# EAGLE board MegaFly_rev3.1 (EAGLE 6.1)
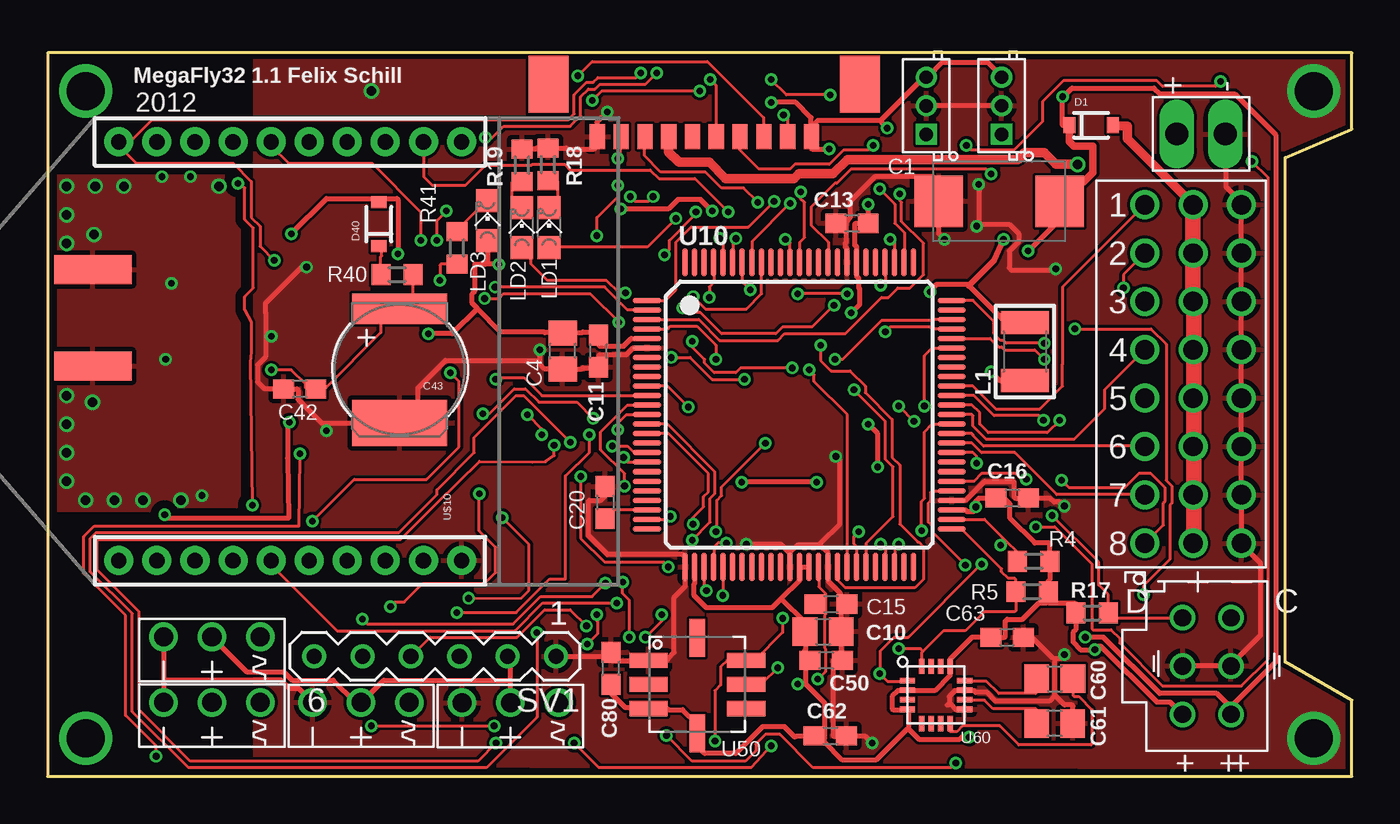
[diagram p3: board, top side]
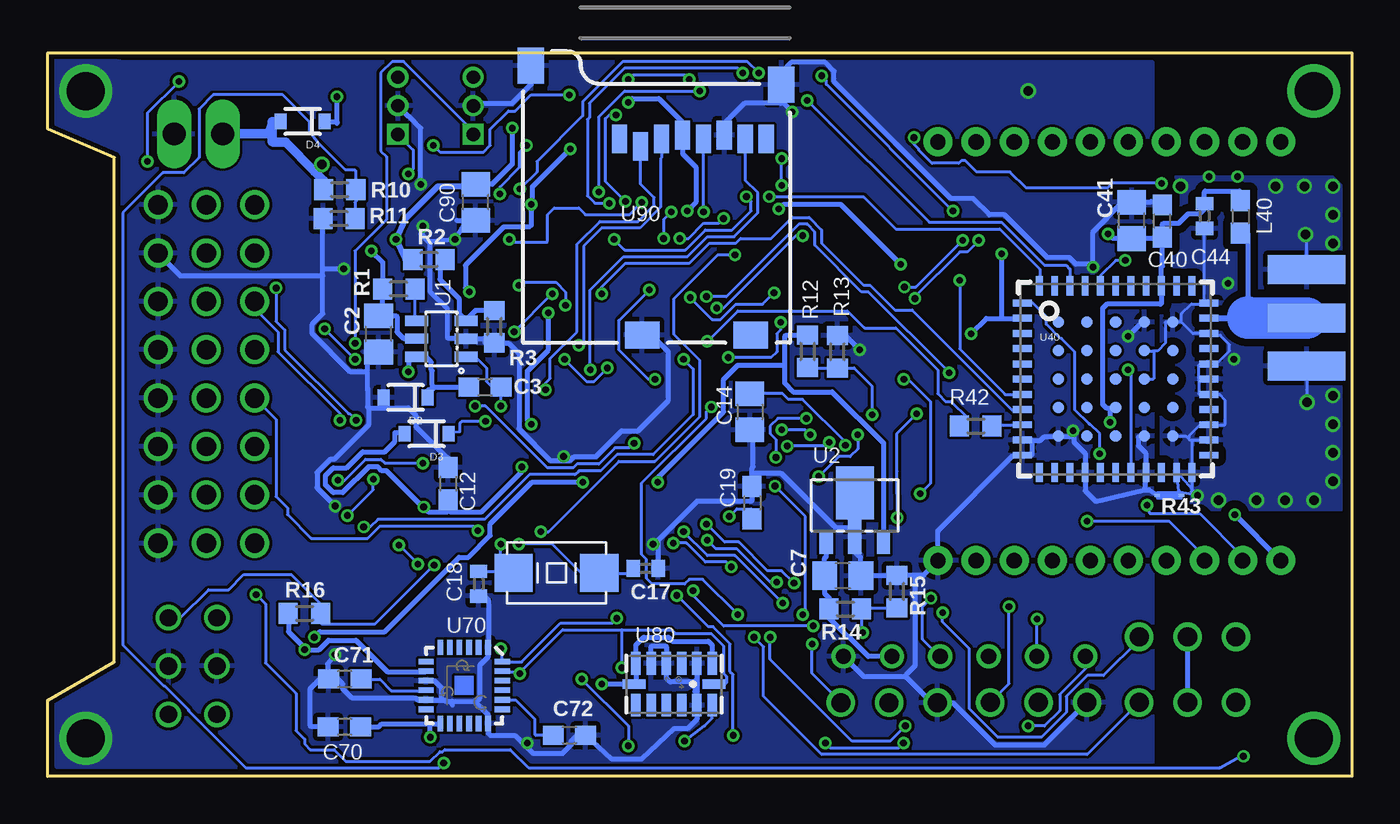
[diagram p4: board, bottom side, seen from below]

Size 68.5 x 38 mm. Coordinates in mm from the lower left corner, seen from the top.
Outline: 0,0 68.5,0 68.5,4 65,6 65,32.5 68.5,34 68.5,38 0,38 0,0
Copper layers (1*16): Top 0.035mm / dielectric 1mm / Bottom 0.035mm
Design rules: minimum track width 0.15mm, minimum drill 0.35mm, track to track 0.15mm, track to pad 0.15mm, pad to pad 0.15mm, via to via 0.15mm, smd to smd 0.15mm, copper to edge 10mil, drill to drill 8mil, minimum pad ring 8mil, minimum via ring 6mil, stop-mask expansion 4mil, vias tented up to drill 0.51mm, thermal gap 10mil
Net classes: 0 default: width 0.15 mm, drill 0.35 mm, clearance 0.15 mm; 1 power: width 0.25 mm, drill 0.35 mm, clearance 0.15 mm; 2 more_power: width 0.5 mm, drill 0.5 mm, clearance 0.15 mm

## Footprints (pad centres in the part's own frame; a part is rotated, then mirrored left to right if it is on the bottom)
D/7343-31R = smd 2.55 x 2.7: + 3.175,0; - -3.175,0
C0805 = smd 1.3 x 1.5: 1 -0.95,0; 2 0.95,0
C0603 = smd 1.1 x 1: 1 -0.85,0; 2 0.85,0
C0402 = smd 0.7 x 0.9: 1 -0.65,0; 2 0.65,0
EN_J2 = smd 5 x 1.6: + 0,-3.2 | smd 5 x 2.4: - 0,2.8
SOD-323 = smd 0.63 x 0.83: 1 -1.15,0; 2 1.15,0
SMA-EDGE = smd 1.524 x 4.064: GND@0 0,0; GND@1 5.08,0; SIG 2.54,0 | smd 1.524 x 4.064 bottom: GND@2 0,0; GND@3 5.08,0
C1210 = smd 1.2 x 2.5: 1 -1.524,0; 2 1.524,0
0603 = smd 1.1 x 1: 1 -0.85,0; 2 0.85,0
CHIPLED_0805 = smd 1.2 x 1.2: A 0,-1.05; C 0,1.05
R0603 = smd 1 x 1.1: 1 -0.85,0; 2 0.85,0
GND-JUMP = smd 0.305 x 0.152: 1 -0.635,0; 2 0.635,0
MA06-1 = drill 0.8 pad 1.27: 1 -6.35,0; 2 -3.81,0; 3 -1.27,0; 4 1.27,0; 5 3.81,0; 6 6.35,0
SOT23-6 = smd 0.55 x 1.2: 1 -0.95,-1.3; 2 0,-1.3; 3 0.95,-1.3; 4 0.95,1.3; 5 0.015,1.3; 6 -0.95,1.3
SOT89 = smd 0.7 x 1.1: 1 -1.5,-1.75; 3 1.5,-1.75 | smd 0.7 x 1.8: 2 0,-1.4 | smd 2 x 2.8: 4 0,0.9
TQFP100 = smd 1.5 x 0.3: 1 -8,6; 2 -8,5.5; 3 -8,5; 4 -8,4.5; 5 -8,4; 6 -8,3.5; 7 -8,3; 8 -8,2.5; 9 -8,2; 10 -8,1.5; 11 -8,1; 12 -8,0.5; 13 -8,0; 14 -8,-0.5; 15 -8,-1; 16 -8,-1.5; 17 -8,-2; 18 -8,-2.5; 19 -8,-3; 20 -8,-3.5; 21 -8,-4; 22 -8,-4.5; 23 -8,-5; 24 -8,-5.5; 25 -8,-6; 51 8,-6; 52 8,-5.5; 53 8,-5; 54 8,-4.5; 55 8,-4; 56 8,-3.5; 57 8,-3; 58 8,-2.5; 59 8,-2; 60 8,-1.5; 61 8,-1; 62 8,-0.5; 63 8,0; 64 8,0.5; 65 8,1; 66 8,1.5; 67 8,2; 68 8,2.5; 69 8,3; 70 8,3.5; 71 8,4; 72 8,4.5; 73 8,5; 74 8,5.5; 75 8,6 | smd 0.3 x 1.5: 26 -6,-8; 27 -5.5,-8; 28 -5,-8; 29 -4.5,-8; 30 -4,-8; 31 -3.5,-8; 32 -3,-8; 33 -2.5,-8; 34 -2,-8; 35 -1.5,-8; 36 -1,-8; 37 -0.5,-8; 38 0,-8; 39 0.5,-8; 40 1,-8; 41 1.5,-8; 42 2,-8; 43 2.5,-8; 44 3,-8; 45 3.5,-8; 46 4,-8; 47 4.5,-8; 48 5,-8; 49 5.5,-8; 50 6,-8; 76 6,8; 77 5.5,8; 78 5,8; 79 4.5,8; 80 4,8; 81 3.5,8; 82 3,8; 83 2.5,8; 84 2,8; 85 1.5,8; 86 1,8; 87 0.5,8; 88 0,8; 89 -0.5,8; 90 -1,8; 91 -1.5,8; 92 -2,8; 93 -2.5,8; 94 -3,8; 95 -3.5,8; 96 -4,8; 97 -4.5,8; 98 -5,8; 99 -5.5,8; 100 -6,8
VENUS638FLPX = smd 1 x 0.36: 1 -4.9,4; 2 -4.9,3.2; 3 -4.9,2.4; 4 -4.9,1.6; 5 -4.9,0.8; 6 -4.9,0; 7 -4.9,-0.8; 8 -4.9,-1.6; 9 -4.9,-2.4; 10 -4.9,-3.2; 11 -4.9,-4; 23 4.9,-4; 24 4.9,-3.2; 25 4.9,-2.4; 26 4.9,-1.6; 27 4.9,-0.8; 28 4.9,0; 29 4.9,0.8; 30 4.9,1.6; 31 4.9,2.4; 32 4.9,3.2; 33 4.9,4 | smd 0.36 x 1: 12 -4,-4.9; 13 -3.2,-4.9; 14 -2.4,-4.9; 15 -1.6,-4.9; 16 -0.8,-4.9; 17 0,-4.9; 18 0.8,-4.9; 19 1.6,-4.9; 20 2.4,-4.9; 21 3.2,-4.9; 22 4,-4.9; 34 4,4.9; 35 3.2,4.9; 36 2.4,4.9; 37 1.6,4.9; 38 0.8,4.9; 39 0,4.9; 40 -0.8,4.9; 41 -1.6,4.9; 42 -2.4,4.9; 43 -3.2,4.9; 44 -4,4.9 | smd 0.6 x 0.6: 45 -3,3; 46 -3,1.5; 47 -3,0; 48 -3,-1.5; 49 -3,-3; 50 -1.5,3; 51 -1.5,1.5; 52 -1.5,0; 53 -1.5,-1.5; 54 -1.5,-3; 55 0,3; 56 0,1.5; 57 0,0; 58 0,-1.5; 59 0,-3; 60 1.5,3; 61 1.5,1.5; 62 1.5,0; 63 1.5,-1.5; 64 1.5,-3; 65 3,3; 66 3,1.5; 67 3,0; 68 3,-1.5; 69 3,-3
BMP085 = smd 2 x 0.8: 1 -2.565,1.27; 2 -2.565,0; 3 -2.565,-1.27; 5 2.565,-1.27; 6 2.565,0; 7 2.565,1.27 | smd 0.8 x 2: 4 0,-2.565; 8 0,2.45
LPCC16_0.5MM = smd 0.8 x 0.3: P$1 -1.5,0.75; P$2 -1.5,0.25; P$3 -1.5,-0.25; P$4 -1.5,-0.75; P$9 1.5,-0.75; P$10 1.5,-0.25; P$11 1.5,0.25; P$12 1.5,0.75 | smd 0.3 x 0.8: P$5 -0.75,-1.5; P$6 -0.25,-1.5; P$7 0.25,-1.5; P$8 0.75,-1.5; P$13 0.75,1.5; P$14 0.25,1.5; P$15 -0.25,1.5; P$16 -0.75,1.5
QFN-24 = smd 0.8 x 0.3: 1 -2,1.25; 2 -2,0.75; 3 -2,0.25; 4 -2,-0.25; 5 -2,-0.75; 6 -2,-1.25; 13 2,-1.25; 14 2,-0.75; 15 2,-0.25; 16 2,0.25; 17 2,0.75; 18 2,1.25 | smd 0.3 x 0.8: 7 -1.25,-2; 8 -0.75,-2; 9 -0.25,-2; 10 0.25,-2; 11 0.75,-2; 12 1.25,-2; 19 1.25,2; 20 0.75,2; 21 0.25,2; 22 -0.25,2; 23 -0.75,2; 24 -1.25,2
LGA14 = smd 0.5 x 1.2: 1 2,1.1; 2 1.2,1.1; 3 0.4,1.1; 4 -0.4,1.1; 5 -1.2,1.1; 6 -2,1.1; 8 -2,-1.1; 9 -1.2,-1.1; 10 -0.4,-1.1; 11 0.4,-1.1; 12 1.2,-1.1; 13 2,-1.1 | smd 1.2 x 0.5: 7 -2.1,0; 14 2.1,0
MICRO-SD-SOCKET-PP = smd 0.8 x 1.5: 1 -8.94,10.7; 2 -7.84,10.3; 3 -6.74,10.7; 4 -5.64,10.9; 5 -4.54,10.7; 6 -3.44,10.9; 7 -2.34,10.7; 8 -1.24,10.7 | smd 1.8 x 1.4: CD1 -2.05,0.4; CD2 -7.75,0.4 | smd 1.4 x 1.9: GND1 -13.6,14.55; GND3 -0.45,13.55
MOLEX_CONNECTOR_10PINS = smd 0.8 x 1.3: P$1 -11.65,-0.65; P$2 -10.4,-0.65; P$3 -9.15,-0.65; P$4 -7.9,-0.65; P$5 -6.65,-0.65; P$6 -5.4,-0.65; P$7 -4.15,-0.65; P$8 -2.9,-0.65; P$9 -1.65,-0.65; P$10 -0.4,-0.65 | smd 2.1 x 3: P$11 -14.2,-3.4; P$12 2.15,-3.4
HEADER3X8 = drill 1.016: P$1 -2.54,10.16; P$2 0,10.16; P$3 2.54,10.16; P$4 -2.54,7.62; P$5 0,7.62; P$6 2.54,7.62; P$7 -2.54,5.08; P$8 0,5.08; P$9 2.54,5.08; P$10 -2.54,2.54; P$11 0,2.54; P$12 2.54,2.54; P$13 -2.54,0; P$14 0,0; P$15 2.54,0; P$16 -2.54,-2.54; P$17 0,-2.54; P$18 2.54,-2.54; P$19 -2.54,-5.08; P$20 0,-5.08; P$21 2.54,-5.08; P$22 -2.54,-7.62; P$23 0,-7.62; P$24 2.54,-7.62
SMD_CRYSTAL_ABM = smd 2 x 2: P$1 -2.25,0; P$2 2.25,0
POWER = drill 1.2 long: P$1 0,2.54; P$2 0,0
XBEE-1 = drill 0.8 pad 1.524: 1 -11,20; 2 -11,18; 3 -11,16; 4 -11,14; 5 -11,12; 6 -11,10; 7 -11,8; 8 -11,6; 9 -11,4; 10 -11,2; 11 11,2; 12 11,4; 13 11,6; 14 11,8; 15 11,10; 16 11,12; 17 11,14; 18 11,16; 19 11,18; 20 11,20
JST_1.5MM_3WAY = drill 0.7 square: P$1 0,1.5 | drill 0.7: P$2 0,0; P$3 0,-1.5
SERVO_COMPACT = drill 1: P$1 0,2.54; P$2 0,0; P$3 0,-2.54
I2C-HEADER = drill 0.9: P$1 -2.54,5.08; P$2 0,5.08; P$3 -2.54,2.54; P$4 0,2.54; P$5 -2.54,0; P$6 0,0

## Placement (x,y rotation side)
C1  100uF  [D/7343-31R]  49.98,30.21 0 top
C2  10uF  [C0805]  51.12,23.23 90 bottom
C3  100nF  [C0603]  45.53,20.44 0 bottom
C4  10uF  [C0805]  27.05,22.34 90 top
C7  10uF  [C0805]  26.73,10.53 180 bottom
C10  10uF  [C0805]  40.73,7.6 0 top
C11  100nF  [C0603]  28.94,22.34 90 top
C12  100nF  [C0603]  47.47,15.37 270 bottom
C13  100nF  [C0603]  42.25,29.05 0 top
C14  10uF  [C0805]  31.62,19.15 270 bottom
C15  100nF  [C0603]  41.14,9.04 0 top
C16  100nF  [C0603]  50.66,14.62 180 top
C17  22pF  [C0402]  37.09,10.92 0 bottom
C18  22pF  [C0402]  45.86,10.11 270 bottom
C19  100nF  [C0603]  31.5,14.37 270 bottom
C20  100nF  [C0603]  29.28,14.38 270 top
C40  100nF  [C0603]  9.96,29.17 90 bottom
C41  10uF  [C0805]  11.57,29.2 90 bottom
C42  100nF  [C0603]  13.24,20.35 180 top
C43  0.2F  [EN_J2]  18.48,21.36 180 top
C44  22pF  [C0402]  7.74,29.43 270 bottom
C50  100nF  [C0603]  40.89,6.09 180 top
C60  220nF  [C0805]  52.9,5.13 0 top
C61  4.7uF  [C0805]  52.89,2.78 180 top
C62  100nF  [C0603]  41.11,2.12 0 top
C63  100nF  [C0603]  50.39,7.31 0 top
C70  100nF  [C0603]  52.91,2.6 180 bottom
C71  100nF  [C0603]  52.89,5.12 180 bottom
C72  2.2nF  [C0603]  41.09,2.16 0 bottom
C80  100nF  [C0603]  29.6,5.67 90 top
C90  10uF  [C0805]  46.02,30.15 90 bottom
D1  [SOD-323]  54.8,34.2 0 top
D2  [SOD-323]  49.7,19.9 180 bottom
D3  [SOD-323]  48.6,18 180 bottom
D4  [SOD-323]  55.1,34.4 180 bottom
D40  [SOD-323]  17.4,29 90 top
JP5  SMA_EDGE  [SMA-EDGE]  2.38,26.62 270 bottom
L1  10uH  [C1210]  51.33,22.31 90 top
L40  33nH  [0603]  5.85,29.39 270 bottom
LD1  [CHIPLED_0805]  26.34,28.83 0 top
LD2  [CHIPLED_0805]  24.9,28.82 0 top
LD3  [CHIPLED_0805]  23.1,29.2 0 top
R1  100k  [R0603]  50.06,25.6 180 bottom
R2  31.6k  [R0603]  48.47,27.14 0 bottom
R3  10k  [R0603]  45.04,23.62 270 bottom
R4  4k7  [R0603]  51.79,11.29 180 top
R5  4k7  [R0603]  51.7,9.7 180 top
R10  10k  [R0603]  53.16,30.81 180 bottom
R11  1k  [R0603]  53.19,29.3 0 bottom
R12  10k  [R0603]  28.59,22.32 90 bottom
R13  1k  [R0603]  27.02,22.3 270 bottom
R14  5.6k  [R0603]  26.61,8.78 180 bottom
R15  1k  [R0603]  23.9,9.7 270 bottom
R16  4k7  [R0603]  55.01,8.55 0 bottom
R17  4k7  [R0603]  54.86,8.58 0 top
R18  1k  [R0603]  26.28,32.14 270 top
R19  1k  [R0603]  24.91,32.1 270 top
R40  330  [R0603]  18.36,26.35 0 top
R41  330  [R0603]  21.5,27.76 270 top
R42  10k  [R0603]  19.76,18.4 0 bottom
R43  0  [GND-JUMP]  9.59,14.75 0 bottom
SV1  [MA06-1]  20.35,6.3 180 top
U1  LM2734  [SOT23-6]  47.81,22.98 90 bottom
U2  LDO_3PINSOT89_MC78LXX  [SOT89]  26.11,13.98 0 bottom
U10  AT32UC3C1512/1256/1128  [TQFP100]  39.48,19 0 top
U40  VENUS638FLPX-L  [VENUS638FLPX]  12.41,20.86 0 bottom
U50  BMP085  [BMP085]  34.12,4.83 0 top
U60  HMC5883L  [LPCC16_0.5MM]  46.66,4.27 0 top
U70  ITG-3200  [QFN-24]  46.62,4.77 270 bottom
U80  ADXL345  [LGA14]  35.61,4.84 0 bottom
U90  USD-SOCKETNEW  [MICRO-SD-SOCKET-PP]  29.52,22.78 0 bottom
U$1  AVR32_JTAG+SERIAL  [MOLEX_CONNECTOR_10PINS]  28.47,32.95 180 top
U$3  SERVOCONNECTOR_X8STANDARD  [HEADER3X8]  60.16,19.87 0 top
U$8  CRYSTAL  [SMD_CRYSTAL_ABM]  41.77,10.68 0 bottom
U$9  POWER  [POWER]  61.85,33.74 90 top
U$10  XBEE-1B1  [XBEE-1]  23.74,22.33 90 top
U$11  SPEKTRUM_RECEIVER  [JST_1.5MM_3WAY]  50.1,35.23 180 top
U$12  SPEKTRUM_RECEIVER  [JST_1.5MM_3WAY]  46.14,35.22 180 top
U$13  SENSOR  [SERVO_COMPACT]  24.3,3.87 270 top
U$15  SENSOR  [SERVO_COMPACT]  8.63,7.32 270 top
U$16  SENSOR  [SERVO_COMPACT]  16.46,3.88 270 top
U$17  SENSOR  [SERVO_COMPACT]  8.63,3.88 270 top
U$18  I2C-BUS  [I2C-HEADER]  62.15,3.25 0 top

## Tracks (layer width: path | path; a pad name or v marks a point on that pad's centre or on a via)
5V_ANA
  Top 0.25: 24.3,5.05 24.3,6.2 24.2,6.3 SV1.2 | 24.3,5.05 24.3,3.9 U$13.P$2 | U$15.P$2 8.65,7.3 10.45,5.5 12.4,5.5 12.85,5.05 15,5.05 16.15,3.9 16.45,3.9 U$16.P$2 16.55,3.95 17.65,5.05 24.3,5.05
  Bottom 0.25: U2.1 27.6,12.2 27.6,11.55 27.7,11.45 27.7,10.65 C7.2 27.7,10.5 27.7,9.6 27.45,9.35 27.45,8.8 R14.2 27.45,8.65 27.45,8.3 26.5,7.35 26.45,7.35 25.4,6.3 SV1.2 | U$17.P$2 8.65,3.9 8.65,7.3 U$15.P$2
+3V3  (via drill 0.35)
  Top 0.25: 22.7,26.9 22.45,26.9 22.45,25.5 22.3,25.35 22.3,24.85 22.57,24.57 | 22.57,24.57 23.8,23.35 26.05,23.35 26.1,23.3 C4.2 27.15,23.3 28.05,23.3 28.1,23.35 28.95,23.35 C11.2 28.95,23.1 28.95,22.65 29,22.6 30.25,22.6 30.65,23 U10.5 | v20,23.25 21.25,23.25 22.57,24.57 | 17.5,30.35 14.65,30.35 v12.8,28.5 | v6.15,13.75 6.35,13.55 12.65,13.55 12.6,16.7 12.6,18.5 v12.7,18.6 | v18.4,27.45 18.4,30.3 18.35,30.35 17.65,30.35 | v43.1,30.05 43.1,29.15 C13.2 43.05,29.05 42.45,29.05 42.4,29 42.4,27.9 42.5,27.8 42.5,27 U10.82 42.5,26.9 42.5,26.25 42.6,26.15 42.6,25.65 42.65,25.6 42.65,24.8 v42.2,24.35 | 40.17,34.17 40.45,34.45 43.75,34.45 | 40.17,34.17 40.1,34.1 40.1,33.6 U$1.P$1 40.1,33.5 40.1,33 40.15,32.95 v41.05,32.95 | 43.75,34.45 46,36.7 46.1,36.7 U$12.P$3 46.25,36.75 47,37.5 49.35,37.5 50.1,36.75 U$11.P$3 | v44.1,34.05 43.8,34.35 43.75,34.45 | v38,35.4 39.3,35.4 40.1,34.6 40.1,34.25 40.17,34.17 | v46.35,25.45 46.35,25.5 46.7,25.85 48.3,25.85 48.38,25.77 50.3,23.85 51.3,23.85 L1.2 | C80.1 29.6,4.35 30.35,3.6 30.55,3.6 30.6,3.55 U50.3 31.65,3.55 32.55,3.55 32.6,3.5 33.35,3.5 34.1,2.75 34.1,2.3 U50.4 34.1,2.15 34.1,1.6 34.5,1.2 36.15,1.2 37.55,2.6 38.7,2.6 39.25,2.05 39.3,2.1 40.15,2.1 C62.1 | 38.52,9.32 39.5,10.3 39.5,11 U10.38 U10.39 | 38.52,9.32 38.05,8.85 34.6,8.85 33.95,9.5 33.95,10.1 34,10.15 34,11 U10.27 | 39.8,4.85 40.8,3.85 40.8,2.15 40.75,2.1 40.3,2.1 C62.1 | 39.8,4.85 39.8,6 C50.2 40,6.1 39.75,6.1 39.75,6.6 39.8,6.65 39.8,7.6 C10.1 39.8,7.7 39.8,8.05 38.52,9.32 | 39.8,4.85 v39.4,4.85 | U10.53 48.2,14 48.3,13.9 48.6,13.9 48.75,14.05 v48.75,14.15 48.75,14.45 48.9,14.6 49.8,14.6 C16.2 49.9,14.6 50.25,14.6 50.55,14.3 50.55,13.55 51.85,12.25 52.6,12.25 52.65,12.2 52.65,11.4 R4.1 52.65,11.25 52.65,10.35 52.55,10.25 R5.1 52.55,9.15
  Top 0.25: 52.55,9.15 52.6,9.1 53.95,9.1 54,9.05 54,8.6 R17.1 54,8.45 54,7.7 53.85,7.55 53.85,7.05 54.25,6.65 54.75,6.65 54.88,6.78 | v48.4,2.05 48,2.05 47.9,1.95 45.75,1.95 45.2,2.5 | 45.2,2.5 45.2,3.4 U60.P$4 45.15,3.5 44.4,3.5 44.35,3.55 44.35,4.2 44.65,4.5 45.15,4.5 U60.P$2 45.25,4.5 46.6,4.5 47.4,5.3 47.4,5.65 U60.P$13 47.4,5.8 47.4,6.15 48.55,7.3 49.5,7.3 C63.1 49.65,7.3 50.25,7.3 50.3,7.35 50.3,8.15 50.4,8.25 51.2,8.25 52.05,9.1 52.45,9.1 52.55,9.15 | 54.88,6.78 54.95,6.85 55.3,6.85 58.25,3.9 58.95,3.9 U$18.P$5 | v55,6.65 54.88,6.78 | C62.1 40.8,2 40.8,1.8 41.75,0.85 43.5,0.85 45.1,2.45 45.2,2.5 | v43.1,18.5 43.6,18 v43.6,16.25 | v23.7,26.9 23,26.9 22.8,26.9 | v30.1,29.8 32.6,29.8 33.1,30.3 34.3,30.3 v34.9,29.7
  Top 0.254: LD3.A 23.1,27 23,26.9 | 22.8,26.9 22.7,26.9 | D40.2 17.5,30.25 17.5,30.35 17.65,30.35
  Top 0.305: v50.2,28.2 49.7,27.1 48.38,25.77
  Bottom 0.25: 18.4,24.05 19.2,24.05 v20,23.25 | 18.4,24.05 17.35,24.05 U40.2 | v12.8,28.5 12.55,28.25 C41.1 10.05,28.25 C40.1 | L40.1 5.85,30.7 5.9,30.75 7.7,30.75 7.75,30.7 7.75,30.3 C44.1 7.75,30.2 7.75,29.8 8,29.55 8.6,29.55 9.1,29.05 9.9,29.05 9.95,29 9.95,28.4 C40.1 | C40.1 9.95,28.3 9.95,26.8 10,26.75 10,25.85 U40.36 10,24.85 10.05,24.8 12.88,24.8 13.1,24.58 13.1,19.55 12.9,19.35 12.45,19.35 U40.58 12.7,19.25 v12.7,18.6 | v6.15,13.75 3.75,11.35 U$10.1 | v18.4,27.45 18.4,24.05 | 43.1,28.95 v43.1,30.05 43.05,30.15 43.05,30.95 v41.05,32.95 | C90.2 45.15,31.1 44.1,32.15 v44.1,34.05 | v38,35.4 37.8,35.6 36.4,35.6 35.15,34.35 35.15,33.7 U90.4 35.15,33.6 35.15,32.7 34.45,32 34.45,30.15 v34.9,29.7 | v46.35,25.45 46.55,25.65 46.55,26.85 44.55,28.85 43.2,28.85 | U80.1 33.6,6.9 33.8,7.1 35.7,7.1 35.9,7.3 37.2,7.3 37.6,6.9 U80.6 37.6,5.85 37.6,4.95 37.55,4.9 37.55,4.85 U80.7 37.8,4.85 v39.4,4.85 | 47.45,13.95 47.45,14.5 C12.2 | 47.45,13.95 47.5,13.9 48.5,13.9 v48.75,14.15 48.85,14.2 50.7,16.05 50.95,16.05 51.15,16.25 51.65,16.25 53,14.9 53.5,14.9 53.9,15.3 53.9,15.8 53.5,16.2 52.8,16.2 51.95,17.05 50.8,17.05 50.25,17.6 50.25,18.05 49.72,18.07 | 54.9,6.65 54.25,6.65 53.75,7.15 52.3,7.15 50.65,5.5 48.65,5.5 U70.8 | 54.9,6.65 55.85,7.6 R16.1 | 48.4,2.75 50.95,2.75 51.1,2.6 C70.1 | 48.4,2.75 47.9,2.75 U70.13 | v48.4,2.05 48.4,2.75 | v55,6.65 54.9,6.65 | v42.2,24.35 42.2,22.4 43.3,21.3 43.3,18.7 v43.1,18.5 | v43.6,16.25 43.6,16 45.7,13.9 47.35,13.9 47.45,13.95 | v23.7,26.9 26.85,30.05 29.85,30.05 v30.1,29.8
  Bottom 0.254: 49.72,18.07 49.75,18.07 D3.2
  Bottom 0.305: R2.1 49.5,26.94 49.7,27.14 v50.2,28.2 49.7,29.3 48,31 46,31 46,31.08 C90.2
+12V  (via drill 0.5)
  Top 0.5: v54.1,32.15 52.95,32.15 52.35,32.75 51.3,32.75 50.95,32.4 42,32.4 41.25,31.65 39.45,31.65 39.2,31.4 35.6,31.4 34.75,32.25 33.15,32.25 32.6,32.8 32.6,33.6 U$1.P$7
  Bottom 0.5: 54.48,31.77 56,33.3 56.65,33.3 56.7,33.35 56.7,34.25 | 54.48,31.77 54,31.3 54,30.85 R10.2 | 56.7,34.25 56.71,34.28 56.9,33.75 U$9.P$1 | 54.48,31.77 v54.1,32.15 | D4.2 56.7,34.4 56.7,34.25
ADC0  (via drill 0.35)
  Top 0.152: U10.10 32.55,20.5 v33.65,19.4 | v32.25,8.5 32.25,8.15 v31.4,7.3
  Bottom 0.152: v33.65,19.4 33.9,19.15 33.9,18.8 37.3,15.4 37.3,11.65 37.05,11.4 37.05,10.4 36.75,10.1 35.05,10.1 34.8,10.35 34.1,10.35 v32.25,8.5 | v31.4,7.3 30.9,6.8 30.9,4.2 27.85,1.15 13.9,1.15 11.2,3.85 U$17.P$1
ADC1  (via drill 0.35)
  Top 0.15: v18.01,8.92 18.25,9.16 18.73,9.16 19.7,10.13 22.95,10.13 23.53,10.71 23.53,12.03 22.67,12.89 v22.67,14.85 | v23.53,20.86 23.61,20.94 25.02,20.94 25.96,20 U10.11
  Bottom 0.15: U$16.P$1 18.01,4.86 v18.01,8.92 | v22.67,14.85 22.12,15.4 22.12,19.67 23.31,20.86 v23.53,20.86
ADC2  (via drill 0.35)
  Top 0.152: U10.12 30.45,19.5 29.05,18.1 29.05,17.15 30.3,15.9 v30.3,15.25 | v28.85,8.5 28.85,8.15 28.9,8.1 28.9,7.5 v28.35,6.95
  Bottom 0.152: v30.3,15.25 28.7,13.65 28.7,8.65 v28.85,8.5 | v28.35,6.95 28.35,5.4 26.85,3.9 U$13.P$1
ADC3  (via drill 0.35)
  Top 0.152: U10.13 30.4,19 29.95,18.55 v29.95,18.2 | v28.45,17.95 28.45,17 27.2,15.79 27.19,10.36 26.37,10.36 24.61,8.6 v21.5,8.6
  Bottom 0.152: v29.95,18.2 28.7,18.2 v28.45,17.95 | v21.5,8.6 21.5,8.1 20.1,6.7 20.1,3.55 18.6,2.05 16.3,2.05 15,3.35 15,4.2 13.9,5.3 13.05,5.3 11.2,7.15 11.2,7.3 U$15.P$1
ADC4  (via drill 0.35)
  Top 0.152: U10.14 32.55,18.5 35.05,16 35.05,14.85 34.8,14.6 34.8,13.35 v33.85,12.4 | v30.2,10.2 30.2,9.6 30.55,9.25 v30.55,7.3 | v17,2.65 v23.45,2.65
  Bottom 0.152: v33.85,12.4 33.4,11.95 32.3,11.95 30.55,10.2 v30.2,10.2 | v30.55,7.3 30.55,6.15 26.25,1.85 24.25,1.85 v23.45,2.65 | v17,2.65 16.15,2.65 15.35,3.45 15.35,4.3 14,5.65 SV1.6
ADC5  (via drill 0.35)
  Top 0.152: U10.15 32.6,18 34.7,15.9 34.7,14.95 34.45,14.7 34.45,14.15 33.9,13.6 v33.9,13.25 | v29.3,10.15 28.6,9.45 25.9,9.45 24.45,8 16.79,8 v16.54,8.25
  Bottom 0.152: v33.9,13.25 32.95,12.3 32.2,12.3 30.7,10.8 29.95,10.8 v29.3,10.15 | v16.54,8.25 SV1.5
ADC7  (via drill 0.35)
  Top 0.152: U10.17 30.8,17 30.45,17.35 v29.65,17.35 | v27.45,17.55 25,20 24.6,20 22.4,17.8 22.4,17 20.45,15.05 20.45,14.8 18.45,12.8 2.55,12.8 2.25,12.5 2.25,10.75 4.45,8.55 4.45,3.4 7.4,0.45 23.05,0.45 25.7,3.1 v25.7,7.55
  Bottom 0.152: R15.2 23.95,8.85 25.75,8.85 25.8,8.8 R14.1 25.75,8.75 25.75,7.8 25.7,7.75 v25.7,7.55 | v29.65,17.35 27.65,17.35 v27.45,17.55
ADC10  (via drill 0.35)
  Top 0.152: v35.65,12.25 35.2,12.25 35,12.05 35,11 U10.29 | v32.6,11 32.35,11.25 29.25,11.25 28,12.5 v28,15.75 | v25.95,17.95 25.95,18.25 v25.2,19
  Bottom 0.152: R12.1 28.75,21.45 27.15,21.45 R13.2 27.05,21.45 26.15,21.45 25.2,20.5 v25.2,19 | v35.65,12.25 34.95,12.25 33.95,11.25 32.85,11.25 v32.6,11 | v28,15.75 26.95,16.8 26.35,16.8 25.95,17.2 v25.95,17.95
ADC11  (via drill 0.35)
  Top 0.152: v35.45,9.5 35.5,9.55 35.5,11 U10.30 | v32.5,2.15 33.85,0.8 36.65,0.8 37.2,1.35 37.2,1.7 37.7,2.2 38.45,2.2 40.2,0.45 47.45,0.45 v47.7,0.7
  Bottom 0.152: R11.2 52.35,29.35 52.35,30.15 52.3,30.2 R10.1 52.3,30.85 52.3,31.8 52.35,31.85 52.85,31.85 54.35,33.35 54.75,33.85 54.75,34.35 55.9,35.55 56.15,35.8 59.8,35.8 60.55,35.05 60.55,32.5 61.35,31.7 62.45,31.7 64.55,29.6 64.55,6.9 62.4,4.75 62.35,4.75 61.1,3.5 61.1,3.45 58.1,0.45 47.95,0.45 v47.7,0.7 | v35.45,9.5 33.8,7.85 33.55,7.85 32.65,6.95 32.65,5.5 32.5,5.35 v32.5,2.15
ANT
  Bottom 0.254: L40.2 5.47,28.54 5.47,24.12
  Bottom 0.305: U40.32 5.47,24.06 5.47,24.08
  Bottom 2.184: JP5.SIG 5.47,24.08 5.47,24.12
BAT_FILTERED  (via drill 0.35)
  Top 0.25: v53.3,35.7 53.4,35.75 53.8,36.15 58.1,36.15 58.4,35.85 62.35,35.85 64.5,33.7 64.5,6 62.15,3.65 U$18.P$6 62.05,3.7 61.4,4.35 58.4,4.35 55.45,7.3 v54.5,7.3 | v51.5,27.6 53.15,29.25 53.15,30.1 C1.+ 53.35,30.5 53.45,30.5 | v40.4,15.45 v36.45,15.45
  Top 0.254: 53.7,34.2 D1.1 53.3,34.2 v53.3,35.7
  Top 0.406: 53.16,30.45 C1.+ 54.15,31.2 54.4,31.2 54.9,31.7 54.9,33.1 53.9,33.1 53.65,33.35 D1.1
  Bottom 0.25: 29.8,21.6 29.8,23.1 29.75,23.15 28.8,23.15 R12.2 | 29.8,21.6 29.8,20.65 29.35,20.2 27.3,20.2 24.6,17.5 24.6,12.25 U2.3 | U1.5 49.15,23 49.8,23 50.15,23.35 50.15,24.15 50.2,24.2 50.8,24.2 C2.2 51.1,24.2 50.9,24.2 50.9,25.55 R1.2 50.9,25.7 50.9,27 v51.5,27.6 | 53.3,34.3 v53.3,35.7 | 29.8,21.6 32.25,21.6 33,20.85 33,19.15 36.45,15.7 v36.45,15.45 | v40.4,15.45 43.05,15.45 45.25,13.25 45.25,12.65 46.4,11.5 46.9,11.5 50.8,7.6 54.2,7.6 v54.5,7.3
  Bottom 0.254: D4.1 53.3,34.4 53.3,34.3
BOOT_SEL
  Bottom 0.152: U40.9 17.35,18.45 18.5,18.45 18.55,18.4 R42.2
D_RXD  (via drill 0.35)
  Top 0.152: v29.95,32.45 30.1,32.6 30.1,33.6 U$1.P$9 | v29.95,31.05 29.95,30.45 28.85,29.35 v28.85,28.4 | v33.35,24.6 33.6,24.35 34.3,24.35 35.4,23.25 38.25,23.25 38.6,23.6 40.15,23.6 v41.3,24.75 | v43.75,25.8 43.85,25.8 44,25.95 44,27 U10.79
  Bottom 0.152: v29.95,31.05 v29.95,32.45 | v28.85,28.4 29.2,28.4 33,24.6 v33.35,24.6 | v41.3,24.75 41.3,25.45 41.8,25.95 43.6,25.95 v43.75,25.8
D_TXD  (via drill 0.35)
  Top 0.152: v37.3,30.15 36.55,30.9 35.4,30.9 34.55,31.75 32.2,31.75 31.35,32.6 31.35,33.6 U$1.P$8 | v44.25,28.2 44.35,28.2 44.5,28.05 44.5,27 U10.78
  Bottom 0.152: v37.3,30.15 37.95,29.5 40.25,29.5 40.6,29.85 41.9,29.85 42.25,29.5 42.25,28.1 42.3,28.05 44.1,28.05 v44.25,28.2
DAC0  (via drill 0.35)
  Top 0.152: v34.6,9.75 34.5,9.85 34.5,11 U10.28 | v28.3,7.9 27.45,8.75 26.1,8.75 24.65,7.3 20.1,7.3 19.1,6.3 SV1.4
  Bottom 0.152: v34.6,9.75 34.6,9.5 33,7.9 v28.3,7.9
DAC1  (via drill 0.35)
  Top 0.152: U10.18 30.45,16.5 30.25,16.7 v30.25,16.75 | v28.65,18.8 27.8,19.65 25.8,19.65 25.1,20.35 24.5,20.35 23.2,19.05 v22.85,19.05 | v23.87,13.59 25.28,12.18 25.28,9.77 24.88,9.37 v22.11,9.35
  Bottom 0.152: v30.25,16.75 30.25,17.7 30.55,18 30.55,18.4 30.15,18.8 v28.65,18.8 | v23.87,13.59 23.89,16.03 23.89,18.01 v22.85,19.05 | v22.11,9.35 22.56,8.9 22.55,7.2 21.65,6.3 SV1.3
GND  (via drill 0.35, 0.5, 2)
  Top 0.25: U10.54 48.2,14.5 49.2,15.5 50.7,15.5 50.75,15.45 50.75,14.7 50.85,14.6 51.5,14.6 C16.1 51.6,14.6 52.65,14.6 52.85,14.4 53.2,14.4 v53.4,14.2 | U$18.P$3 59.65,5.8 U$18.P$4 62.2,5.9 63.7,7.4 63.7,11.2 62.75,12.15 U$3.P$24 62.7,14.75 U$3.P$21 62.7,14.9 62.7,17.3 U$3.P$18 62.7,17.45 62.7,19.85 U$3.P$15 62.7,19.95 U$3.P$12 62.7,22.5 62.7,24.9 U$3.P$9 62.7,25.05 62.7,27.45 U$3.P$6 62.7,27.6 62.7,30 U$3.P$3 62.7,30.15 61.9,30.95 61.9,33.7 U$9.P$2 | C20.1 29.3,15.2 29.3,14.75 29.05,14.5 28.45,14.5 28.4,14.45 28.4,12.65 29.4,11.65 33.35,11.65 33.5,11.5 33.5,11 U10.26 33.5,10.9 33.5,10 32.9,9.4 32.9,6.5 32.6,6.2 32.55,6.1 31.65,6.1 U50.1 30.6,6.1 30.55,6.05 29.65,6.05 29.6,6.1 C80.2 29.5,6.3 SV1.1 | 6.1,5.05 6.1,7.3 U$15.P$3 | 6.1,5.05 6.1,3.9 U$17.P$3 | 6.1,5.05 12.25,5.05 12.7,4.6 13.2,4.6 13.9,3.9 U$16.P$3 | 25.85,21.85 25.85,21.65 26.1,21.4 C4.1 27.15,21.4 28.05,21.4 28.1,21.45 28.9,21.45 C11.1 28.95,21.6 28.95,22.1 29,22.15 30.4,22.15 30.75,22.5 U10.6 | 25.85,21.85 v25.85,22.4 | 25.85,21.85 20.9,21.85 19.45,20.4 19.45,18.6 19.4,18.55 18.5,18.55 C43.- 18.4,18.55 14.65,18.55 | R19.1 24.95,32.95 25.65,32.95 25.7,33 26.25,33 R18.1 26.4,33 27.25,33 27.3,32.95 28.7,32.95 28.85,33.1 28.85,33.6 U$1.P$10 28.85,33.7 28.85,34.35 v29.4,34.9 | v13.6,26.75 13.35,26.75 11.45,24.85 11.45,24.35 | 14.65,18.55 14.4,18.55 13.15,19.8 13.15,20.3 13.1,20.35 12.5,20.35 C42.2 12.35,20.35 11.4,20.35 11.38,20.37 | U$11.P$2 50.1,35.25 46.15,35.25 U$12.P$2 | 41.9,29.05 C13.1 | 41.9,29.05 41.95,29 41.95,28.05 41.9,28 41.9,27.8 42,27.7 42,27 U10.83 | 41.9,29.05 41.95,29.15 42.15,29.35 42.15,30.2 43.45,31.5 46.5,31.5 46.8,31.2 46.8,30.25 C1.- 46.8,30.1 46.8,28.5 v47.1,28.2 47.2,28.15
  Top 0.25: 39,11.75 39,11 U10.37 | 39,11.75 39.4,12.15 40.55,12.15 | 40.55,12.15 41,11.7 41,11 U10.41 41,10.9 41,10.25 41.65,9.6 41.65,9.15 C15.2 41.95,9.05 41.7,9.05 41.7,7.65 C10.2 41.7,7.5 41.7,6.2 C50.1 41.7,6.1 41.3,6.1 41.25,6.05 41.25,2.15 41.3,2.1 41.95,2.1 C62.2 42.05,2.1 42.95,2.1 v43.3,1.75 | 47.38,3.83 47.35,3.85 47.35,4.2 47.65,4.5 48.15,4.5 U60.P$11 48.25,4.5 48.65,4.5 48.75,4.4 49.35,4.4 49.8,3.95 52.6,3.95 52.9,4.25 | 47.38,3.83 47.7,3.5 48.15,3.5 U60.P$9 | 52.9,4.25 52.9,6 | 52.9,4.25 53.4,3.75 53.8,3.75 53.85,3.7 53.85,2.8 C61.1 | C63.2 51.7,7.3 52.8,6.2 53.2,6.2 v53.4,6.4 | 47.25,3.75 47.3,3.75 47.38,3.83 | 21.75,11.35 U$10.10 | v36.7,12.2 38.5,12.2 38.9,11.8 39,11.75 | v41.4,16.8 41.6,16.6 41.6,13.25 40.6,12.25 40.55,12.15 | v14.65,18.15 14.65,18.55 | 11.45,24.35 11.45,22.03 11.03,21.61 11.03,20.72 11.38,20.37 | 11.38,20.37 11.47,20.37 | 11.45,24.35 11.46,24.34 11.46,23 11.57,23.11 v11.76,23.11 | 48.9,29 50.5,29 51,28.5 51,28.1 50.5,27.6 50.5,26.7 50.6,26.6 53,26.6 53.1,26.7 | v48.9,31.1 48.9,29 | 48.9,29 v48.8,28.9
  Bottom 0.25: 51.65,19.35 49.55,19.35 49.15,18.95 49.15,18.35 47.55,16.75 47.5,16.75 47.45,16.7 47.45,16.25 C12.1 | 51.65,19.35 51.7,19.4 51.7,20.3 51.68,20.3 51.7,20.4 51.7,21.2 51.75,21.25 | 54.05,26.3 54.05,24.3 54.6,23.75 54.6,23.25 52.6,21.25 51.75,21.25 | 54.05,26.3 54.05,26.65 | 54.05,26.65 R11.1 | C2.1 51.15,22.3 51.6,22.3 51.7,22.2 51.7,21.35 51.75,21.25 | v53.4,14.2 54.35,15.15 54.35,15.95 53.65,16.65 53.45,16.65 51.65,18.45 51.65,19.35 | 54.05,26.3 61.55,26.3 62.7,27.45 U$3.P$6 | U80.5 36.8,6.8 36.75,6.85 36.05,6.85 36,6.8 U80.4 36,5.85 36,5.15 35.8,4.95 34.5,4.95 | 34.5,4.95 34.5,5 34.4,5.1 34.4,5.9 U80.2 34.41,3 34.9,2.5 35.6,2.5 37.3,0.9 38.88,0.9 C72.2 40.7,2.15 41,1.85 41,1.65 41.45,1.2 43,1.2 43.42,1.62 | 34.5,4.95 34.5,4.85 | 34.5,4.85 34.5,4.45 34.4,4.35 U80.12 | 34.6,4.85 34.5,4.85 | 23.45,5.25 22.1,3.9 21.8,3.9 U$13.P$3 21.65,3.85 20.95,3.85 18.75,1.65 16.15,1.65 13.95,3.85 U$16.P$3 | 23.45,5.25 25.65,5.25 SV1.1 | v25.85,22.4 26.6,23.15 27.1,23.15 R13.1 | 29.95,35.4 30,35.35 31.9,35.35 32.95,34.3 32.95,33.7 U90.6 | 29.95,35.4 29.95,36.3 U90.GND3 29.95,36.45 29.95,37 29.45,37.5 27.65,37.5 27.2,37.05 27.2,36.5 21.05,30.35 19.9,30.35 19.05,29.5 18.25,29.5 16,27.25 14.85,27.25 14.5,26.9 13.7,26.9 v13.6,26.75 13.6,28.6 12.05,30.15 C41.2 10.6,30.15 10.55,30.2 9.95,30.2 9.95,30.05 C40.2 | v29.4,34.9 29.85,35.35 29.95,35.4 | U90.GND1 43.1,37.3 43.1,36.35 44.1,35.35 46,35.35 46.1,35.25 U$12.P$2 | 48.4,28 48.4,25.45 47.5,24.55 47.5,23.05 47.45,23 46.6,23 U1.2 46.5,23 45.6,23 45.55,22.95 45.55,22.8 45.5,22.75 45.05,22.75 R3.2 44.95,22.75 44.3,22.75 43.75,22.2 43.75,18.25 42.1,16.6 41.4,16.6
  Bottom 0.25: 48.4,28 48.4,28.1 v47.1,28.2 46.5,29.2 C90.1 47,29.2 | 41.4,16.6 41.05,16.6 40.85,16.8 39.7,16.8 38.35,18.15 37.5,18.15 35.9,19.75 35.9,22.3 36.8,23.2 37.25,23.2 U90.CD2 | v48.9,31.1 48.9,34.05 49.55,34.7 49.6,34.7 50.1,35.2 U$11.P$2 | 53.8,5.1 54.2,5.1 54.7,4.6 54.7,2.65 54.65,2.6 53.8,2.6 C70.2 | 53.8,5.1 53.75,5.1 C71.2 53.65,5.1 53.25,5.1 53,4.85 53,4.6 52.5,4.1 49.15,4.1 49.05,4 48.7,4 U70.11 48.6,4 47.8,4 | C18.2 45.55,9.45 45.35,9.25 45.35,6.8 U70.1 45.35,6.65 45.35,6.3 45.8,5.85 45.8,4.1 46.02,3.88 | 46.02,3.88 46.1,3.95 47.25,3.95 | 46.02,3.88 45.35,3.2 45.35,2.8 U70.18 45.35,2.65 45.35,2.25 45.25,2.15 43.95,2.15 43.42,1.62 | 47.25,3.95 47.6,3.95 47.65,4 47.8,4 | 47.8,4 47.8,4.65 48.15,5 48.6,5 U70.9 | 47.25,3.75 47.25,3.95 | v43.3,1.75 43.42,1.62 | 36.45,12.2 36.45,12.4 34.4,14.45 31.55,14.45 31.5,14.5 31.5,15.2 C19.1 31.5,15.3 31.5,15.9 | 36.45,12.2 36.45,10.95 C17.2 | 31.5,15.9 31.5,16.2 31.45,16.25 31.45,18.2 31.6,18.2 C14.2 | 10.9,15.05 10.65,15.05 R43.1 | 10.9,15.05 U40.19 10.8,16.05 10.8,16.95 11.2,17.35 11.2,17.85 10.95,17.85 U40.64 | 16.8,17.65 U40.10 | 16.8,17.65 16.35,17.65 16.15,17.85 15.45,17.85 U40.49 15.3,17.85 14.65,17.85 | 14.65,17.85 14.6,17.8 14.6,17.55 14,16.95 14,16 U40.15 14,15.85 14,15 13.45,14.45 10.9,15.05 | 16.8,17.65 16.8,16.9 16.85,16.85 U40.11 17.4,16.85 17.8,16.85 21.75,12.9 21.75,11.45 U$10.10 21.75,11.3 22.5,10.55 22.95,10.55 | 22.95,10.55 23.8,10.55 R15.1 23.95,10.55 25.75,10.55 C7.1 25.8,10.65 25.8,11.5 26.1,11.8 26.1,12.55 U2.2 26.1,12.7 26.1,13 26.15,13.05 27.1,13.05 29.95,15.9 31.5,15.9 | 36.45,12.2 v36.7,12.2
  Bottom 0.25: v41.4,16.8 41.4,16.6 | 14.65,17.85 v14.65,18.15 | 22.95,10.55 22.95,5.8 23.4,5.35 23.45,5.25 | v52.95,26.65 54.05,26.65 | v11.76,23.11 11.01,23.86 U40.60 | 48.9,28.5 48.4,28 | v48.8,28.9 48.8,28.6 | v53.4,6.4 53.8,5.9 53.8,5.1
  other vias: 66.5,36 66.5,2 17,36
  pour Bottom: 10.5,37.5 10.5,0.5 68,0.5 68,38 64.5,37.5
  pour Top: 10.9,37.6 10.9,0.6 68.5,0.5 68.5,37.5
GPS_BOOT_SEL  (via drill 0.35)
  Top 0.152: v33.85,22.85 33.85,22.55 34.5,21.9 34.5,21.7 35,21.2 36.15,21.2 36.4,21.45 v39.1,21.45 | v41.35,21.9 41.75,21.9 43.8,23.95 46.4,23.95 46.45,24 U10.73
  Bottom 0.152: v33.85,22.85 32.25,24.45 26.5,24.45 25.6,23.55 23.95,23.55 21.75,21.35 21.75,20.1 21.35,19.7 21.05,19.7 20.2,18.85 20.2,18.4 R42.1 | v39.1,21.45 39.8,20.75 40.2,20.75 v41.35,21.9
GPS_PSE_SEL  (via drill 0.35)
  Top 0.152: v42,25.35 v39.4,25.35 | v44,23.35 44.25,23.6 46.35,23.6 46.45,23.5 U10.72
  Bottom 0.152: v39.4,25.35 39.4,25.7 38.15,26.95 34.8,26.95 33.75,28 32.35,28 32.1,28.25 30.5,28.25 29.4,29.35 28.5,29.35 27.85,28.7 27.85,28 25.65,25.8 25.3,25.8 24,24.5 23.1,24.5 17.85,19.25 17.35,19.25 U40.8 | v44,23.35 v42,25.35
GPS_RSTN  (via drill 0.35)
  Top 0.152: v13.25,16.95 13.25,16.8 13.2,13.15 2.45,13.15 1.9,12.6 1.9,10.65 4.1,8.45 4.1,3.2 5.7,1.6 v5.7,1.05 | v57.55,9.55 57.55,10 58.95,11.4 58.95,14.25 59.05,14.35 59.05,15.25 58.75,15.55 58.75,22.7 57.95,23.5 v53.95,23.5 | v52.35,21.9 51.85,22.4 50.25,22.4 50.1,22.55 49.95,22.55 49.5,23 U10.71
  Bottom 0.152: v13.25,16.95 13.25,18 13.75,18.5 13.8,18.5 14.55,19.25 14.55,22.3 15.25,23 15.3,23 16.05,23.75 16.05,24.15 16.75,24.85 U40.1 | v5.7,1.05 5.85,1.05 6.95,0.45 43.25,0.45 44.2,1.4 47.65,1.4 47.75,1.3 47.9,1.3 48.4,0.8 52.85,0.8 53.45,1.4 54.7,1.4 55,1.7 55,1.95 55.45,2.4 55.45,4.35 57.05,5.95 57.05,9.05 v57.55,9.55 | v52.35,21.9 v53.95,23.5
GPS_RXD0  (via drill 0.35)
  Top 0.152: v28.6,35.5 29.1,36 v34.25,36 | v39.55,30.7 39.55,30.35 39.75,30.15 39.75,28.3 39.5,28.05 39.5,27 U10.88
  Bottom 0.152: v28.6,35.5 22.2,29.1 18.4,29.1 16.15,26.85 15,26.85 14.8,26.65 14.8,25.8 U40.42 | v34.25,36 38.2,36 39.55,34.65 v39.55,30.7
GPS_TXD0  (via drill 0.35)
  Top 0.152: v30.6,30.45 30.85,30.2 31.55,30.2 v31.8,30.45 | v38.75,28.2 38.85,28.2 39,28.05 39,27 U10.89
  Bottom 0.152: v30.6,30.45 25.65,30.45 23.95,28.75 18.5,28.75 16.4,26.65 16.4,25.8 U40.44 | v31.8,30.45 31.55,30.2 31.55,29.7 32.55,28.7 33.95,28.7 35,27.65 38.2,27.65 v38.75,28.2
LED1  (via drill 0.35)
  Top 0.152: v33,29.3 31.5,27.8 26.35,27.8 LD1.A | v35.3,28.25 35.5,28.05 35.5,27 U10.96
  Bottom 0.152: v33,29.3 33.25,29.05 34.05,29.05 34.85,28.25 v35.3,28.25
LED2  (via drill 0.35)
  Top 0.152: v30.35,25.4 30,25.4 29.35,26.05 26.25,26.05 25.4,26.9 25.4,27.7 25.35,27.75 24.95,27.75 LD2.A | v34.75,25.15 34.75,25.7 35,25.95 35,27 U10.97
  Bottom 0.152: v30.35,25.4 30.95,24.8 32.35,24.8 33.15,24 33.6,24 v34.75,25.15
N$1  (via drill 0.35)
  Top 0.152: v34.8,36.6 35.1,36.3 35.1,33.6 U$1.P$5 | v38,36.6 38.8,35.8 v41.1,35.8 | v48.25,33.15 48.5,32.9 50.75,32.9 52.25,34.4 52.25,35.45 53.35,36.55 58.25,36.55 58.55,36.25 61.35,36.25 v61.6,36.5 | v63.25,32.3 64.1,31.45 64.1,6.15 62.7,4.75 58.55,4.75 56.3,7 56.3,7.25 55.85,7.7 54.9,7.7 54.85,7.75 54.85,11.15 52.9,13.1 v51.9,13.1 | v35.1,21.9 35.1,22.65 34.1,23.65 32.7,23.65 32.55,23.5 U10.4
  Bottom 0.152: v34.8,36.6 35.05,36.85 37.75,36.85 v38,36.6 | v41.1,35.8 43.1,35.8 43.95,34.95 44.3,34.95 45.25,34 45.25,33.15 45.6,32.8 47.9,32.8 v48.25,33.15 | v61.6,36.5 63.25,34.85 v63.25,32.3 | v51.9,13.1 51.55,13.1 51.15,13.5 45.55,13.5 43.2,15.85 40.8,15.85 40.6,16.05 39.45,16.05 38.6,16.9 36.7,16.9 34.6,19 34.6,21.4 v35.1,21.9
N$2  (via drill 0.35)
  Top 0.152: v43.35,33.15 43.1,32.9 41.8,32.9 41.05,32.15 39.25,32.15 39,31.9 37.35,31.9 36.35,32.9 36.35,33.6 U$1.P$4 | v44.75,30.6 44.75,30.25 44.85,30.15 44.85,29.15 46,28 46,26.35 45.3,25.65 44.65,25.65 44.15,25.15 43.8,25.15 41.9,23.25 38.7,23.25 38.35,22.9 35.3,22.9 34.2,24 U10.3
  Bottom 0.152: v43.35,33.15 43.7,32.8 43.7,32 44.75,30.95 v44.75,30.6
N$3  (via drill 0.35)
  Top 0.152: v44.7,12.2 44.65,12.2 44.5,12.05 44.5,11 U10.48
  Bottom 0.152: C18.1 44.9,10.75 44.85,10.7 44.05,10.7 U$8.P$1 44.7,10.75 v44.7,12.2
N$4  (via drill 0.35)
  Top 0.152: v43.75,12.2 43.85,12.2 44,12.05 44,11 U10.47
  Bottom 0.152: C17.1 37.75,10.9 37.75,10.65 38.5,10.65 38.55,10.7 39.5,10.7 U$8.P$2 39.55,10.7 40.5,10.7 42,12.2 v43.75,12.2
N$5
  Top 0.152: R18.2 26.3,31.3 26.75,31.3 26.8,31.25 26.8,29.95 26.75,29.9 26.35,29.9 LD1.C
N$6
  Bottom 0.152: R1.1 49.2,25.55 49.2,23.95 49.15,23.9 U1.4
N$7
  Top 0.152: R19.2 24.45,31.25 24.4,31.2 24.4,29.9 24.45,29.85 24.9,29.85 LD2.C
N$8  (via drill 0.35)
  Top 0.25: v49.55,21.25 50,20.8 51.3,20.8 L1.1
  Bottom 0.25: C3.1 46.4,20.45 48.3,20.45 48.3,20.3 48.28,20.3 48.3,20.55 48.3,21.3 48.35,21.35 48.35,21.75 48.65,22.05 49.1,22.05 U1.6 49.2,22.05 49.5,22.05 49.55,22 v49.55,21.25
  Bottom 0.254: 48.3,20.3 48.5,20.3 48.5,19.9 D2.1 48.6,19.9 48.6,19.8
N$9
  Bottom 0.25: 44.65,24.5 44.7,24.45 45,24.45 R3.1 46.03,24.47 46.55,23.95 | 46.55,23.95 46.6,23.9 | R2.2 47.92,27.12 47.9,27.1 47.9,26.1 46.9,25.1 46.9,24.32 U1.3 46.53,23.93 46.55,23.95
N$10  (via drill 0.35)
  Top 0.152: v44.7,19.45 v45.5,18.65
  Bottom 0.152: U1.1 46.5,22.05 46.05,22.05 45.45,21.45 45.45,20.75 45.15,20.45 44.7,20.45 C3.2 44.7,20.4 v44.7,19.45 | v45.5,18.65 46.75,18.65 46.85,18.55 46.85,18.1 47.42,18.07
  Bottom 0.254: D3.1 47.42,18 47.42,18.07
N$11
  Bottom 0.152: U70.20 44.6,4 43.9,4 42.9,3 42.9,2.2 42.85,2.15 C72.1
N$12
  Top 0.152: U60.P$10 48.2,4 49.2,4 49.65,3.55 51.9,3.55 51.95,3.5 51.95,2.8 C61.2
N$13
  Top 0.152: U60.P$8 47.4,2.75 47.4,2.35 47.75,2.35 48.05,2.65 50,2.65 51,1.65 54.8,1.65 54.85,1.7 54.85,3.5 54.15,4.2 53.9,4.2 53.85,4.25 53.85,5.1 C60.2
N$14
  Top 0.152: U60.P$12 48.2,5 49.3,5 49.95,4.35 51.9,4.35 51.95,4.4 51.95,5.1 C60.1
N$15
  Bottom 0.152: U70.10 48.65,4.5 50.45,4.5 51.05,5.1 52,5.1 C71.1
N$16
  Top 0.15: R41.1 21.5,28.7 23.05,30.25 LD3.C
N$17  (via drill 0.35)
  Top 0.152: v27.85,36.8 28.6,37.55 34.65,37.55 37.6,34.6 37.6,33.6 U$1.P$3 | v20.95,29.7 20.45,29.2 v20.45,28.15 | v23.5,25.7 29.25,25.7 30.45,24.5 U10.2
  Bottom 0.152: v27.85,36.8 27.6,36.55 27.6,36.35 v20.95,29.7 | v20.45,28.15 22.9,25.7 v23.5,25.7
N$19  (via drill 0.35)
  Top 0.152: 40.85,9.05 C15.1 | 40.85,9.05 40.85,9.6 40.5,9.95 40.5,11 U10.40 | v26.6,17.4 26.6,16.85 26.16,16.53 25.46,16.51 22.68,16.55 20.45,14.35 18.55,12.45 2.65,12.45 2.6,12.4 2.6,10.85 4.8,8.65 4.8,3.5 7.5,0.8 22.6,0.8 v23.55,1.75 | v27.65,1.75 28.95,0.45 36.95,0.45 v38,1.6 | v40.45,5.1 40.85,5.5 40.85,6.7 40.8,6.75 40.8,8.45 40.85,8.5 40.85,9.05
  Bottom 0.152: v26.6,17.4 26.6,17.55 28.85,19.8 29.6,19.8 29.9,20.1 31.6,20.1 C14.1 | v23.55,1.75 23.8,1.5 27.4,1.5 v27.65,1.75 | v38,1.6 38,2.65 v40.45,5.1
N$20
  Top 0.15: 17.55,28 D40.1
  Top 0.152: 17.55,28 17.55,27.35 17.5,27.3 R40.1
N$22  (via drill 2)
  other vias: 2,36
N$23  (via drill 2)
  other vias: 2,2
N$29  (via drill 0.35)
  Top 0.152: v38.65,34.75 38.85,34.55 38.85,33.6 U$1.P$2 | v38.15,30.2 36.8,28.85 33.8,28.85 33,28.05 33,25.55 32.45,25 U10.1
  Bottom 0.152: v38.65,34.75 39,34.75 39.2,34.55 39.2,31.25 v38.15,30.2
N$31  (via drill 0.35)
  Top 0.152: v32.7,13.65 32.55,13.5 U10.24
  Bottom 0.152: v32.7,13.65 32.3,14.05 31.55,14.05 31.5,14 31.5,13.55 C19.2
N$32
  Top 0.152: U10.23 29.35,14 29.3,13.95 29.3,13.55 C20.2
NAV  (via drill 0.35)
  Top 0.152: v20.6,26.05 20.6,26.85 20.65,26.9 R41.2
  Bottom 0.152: v20.6,26.05 20.6,22.45 18.2,20.05 17.35,20.05 U40.7
PPS  (via drill 0.35)
  Top 0.152: v11.9,27.1 11.15,27.85 11.15,28.9 10.7,29.35 10.7,31.25 9.75,32.2 4.65,32.2 3.75,33.1 3.75,33.3 U$10.20 3.95,32.95 5.5,34.5 27.35,34.5 27.65,34.8 27.65,35.8 28.3,36.45 28.65,36.45 28.9,36.7 30.9,36.7 v31.15,36.95 | v43.7,30.85 44.5,30.05 44.5,29.05 45,28.55 45,27 U10.77
  Bottom 0.152: v11.9,27.1 12.4,27.1 13.2,26.3 13.2,25.8 U40.40 | v43.7,30.85 42.8,31.75 42.8,32.3 40.4,34.7 40.4,35.45 38.3,37.55 31.75,37.55 v31.15,36.95
PWM0
  Top 0.15: 49.8,19.3 52.1,19.3 53.3,20.5 53.3,21.65
  Top 0.152: U10.66 48.6,20.5 49.8,19.3 | 53.3,21.65 53.3,25.7 57.6,30 U$3.P$1
PWM1  (via drill 0.35)
  Top 0.152: U10.65 48.65,20 49.7,18.95 52.05,18.95 v52.3,18.7 | v56.5,25.65 56.5,26.35 57.6,27.45 U$3.P$4
  Bottom 0.152: v52.3,18.7 52.65,19.05 52.7,19.05 56.05,22.4 56.05,23.45 56.5,23.9 v56.5,25.65
PWM2  (via drill 0.35)
  Top 0.152: U10.64 48.55,19.5 48.95,19.1 48.95,18.5 49.4,18.05 52.5,18.05 v53.15,18.7
  Bottom 0.152: v53.15,18.7 53.15,19.05 56.4,22.3 56.4,23.35 57.6,24.55 57.6,24.9 U$3.P$7
PWM3
  Top 0.152: U10.63 48.55,19 48.6,18.95 48.6,18.4 49.3,17.7 53.9,17.7 55.5,19.3 55.5,20.3 57.6,22.4 U$3.P$10
PWM4  (via drill 0.35)
  Top 0.152: U10.62 46.45,18.5 46.05,18.1 46.05,14.6 45.9,14.45 v45.9,12.9
  Bottom 0.152: v45.9,12.9 46.15,13.15 51.05,13.15 51.7,12.5 54.65,12.5 55.9,13.75 55.9,14.1 56.5,14.7 56.5,18.75 57.6,19.85 U$3.P$13
PWM5
  Top 0.152: U10.61 48.55,18 48.6,17.95 48.6,17.9 49.15,17.35 57.6,17.35 U$3.P$16
PWM6
  Top 0.152: U10.60 48.55,17.5 49.05,17 50.8,17 53,14.8 57.6,14.8 U$3.P$19
PWM7  (via drill 0.35)
  Top 0.152: U10.59 48.6,17 48.8,16.8 v48.8,16.45 | v53.25,15.55 53.65,15.15 56.55,15.15 57.3,15.9 57.95,15.9 58.7,15.15 58.7,14.45 58.6,14.35 58.6,13.2 57.65,12.25 U$3.P$22
  Bottom 0.152: v48.8,16.45 50.8,16.45 51,16.65 51.8,16.65 52.9,15.55 v53.25,15.55
RFGND  (via drill 0.35, 0.5)
  Bottom 0.15: 8.95,23.85 8.95,24.3 8.43,24.82 7.55,24.82 U40.33 | U40.29 7.12,21.66 6.43,22.35 6.43,22.68 6.91,23.16 7.41,23.16 U40.31 | JP5.GND@1 2.85,21.54 2.89,21.5 2.42,21.5 JP5.GND@1 | JP5.GND@2 2.38,26.72 2.46,26.8 2.46,26.76 2.4,26.7 2.4,26.64 JP5.GND@2 | JP5.GND@1 2.38,20.3 2.36,20.28 v2.36,19.65 | JP5.GND@2 2.38,28.41 v2.43,28.46
  Bottom 0.152: v8.1,14.75 9.15,14.95 R43.2 9.1,15 U40.21 9.2,16 v8.1,14.75 | v8.1,14.75 7.85,14.7 8.45,14.95 8.4,15 U40.22 8.4,16 8.4,17.65 | 8,20.85 8.05,20.8 8.05,20.1 8,20.05 7.55,20.05 U40.27 7.45,20.05 6.95,20.05 6.65,19.75 6.65,18.5 6.7,18.45 7.45,18.45 U40.25 7.55,18.45 8,18.45 8.55,17.9 8.55,17.8 8.6,17.75 | 8,20.85 7.55,20.85 U40.28 | U40.29 7.55,21.65 8,21.65 8.05,21.6 8.05,20.9 8,20.85 | 8.6,17.75 8.5,17.65 8.4,17.65 | 8.6,17.75 8.7,17.85 U40.69 | 8.4,17.65 7.55,17.65 U40.24 | 10.4,22.3 10.4,20.9 10.45,20.85 U40.62 | 10.4,22.3 10.45,22.35 U40.61 | U40.31 7.55,23.25 8.35,23.25 8.95,23.85 U40.65 9.45,23.85 9.8,23.85 9.8,22.75 10.2,22.35 10.35,22.35 10.4,22.3 | C44.2 7.75,28.55 7.75,24.85 7.55,24.85 U40.33
  other vias: 1,28 1,29.5 1,31 2.5,31 4,31 6,31.5 7.5,31.5 9,31 1,20 1,18.5 1,17 1,15.5 2,14.5 3.5,14.5 5,14.5 7,14.5 6.2,21.9 6.5,25.9
  pour Bottom (isolate 0.406): 0.5,31 0.5,14 10,14 10,31.5 1,31.5
  pour Top (isolate 0.406): 0.5,14 0.5,31.5 10,31.5 10,14
RXD0  (via drill 0.35)
  Top 0.152: v39,30.1 37,28.1 37,27 U10.93 | v32,36.95 31.4,36.35 29,36.35 28.75,36.1 28.4,36.1 28,35.7 28,34.7 27.45,34.15 23.95,34.15 23.35,33.55 v23,33.55 | v10,31.15 10.1,31.15 10.35,30.9 10.35,29.25 10.8,28.8 10.8,25.65 10.35,25.2 10.35,24.5 10.7,23.85 10.7,22.3 10.65,21.75 v10.75,14.25
  Bottom 0.152: v39,30.1 39.75,30.1 40.15,30.5 40.15,34.5 40.05,34.6 40.05,35.35 38.2,37.2 32.25,37.2 v32,36.95 | v23,33.55 23,33.2 22.75,32.95 22.75,32.9 22.05,32.2 20.65,32.2 20.5,32.35 20.3,32.35 19.7,31.75 17.95,31.75 17.1,30.9 12.85,30.9 12.6,31.15 v10,31.15 | v10.75,14.25 10.75,14.05 10.6,13.8 8,13.8 5.75,11.55 5.75,11.4 U$10.2
S_RXD1  (via drill 0.35)
  Top 0.152: v49.55,31.65 49.3,31.9 42.2,31.9 41.45,31.15 41.35,31.15 40.1,29.9 40.1,28.95 41,28.05 41,27 U10.85
  Bottom 0.152: v49.55,31.65 49.3,31.9 49.3,32.9 50.1,33.7 U$11.P$1
S_RXD2  (via drill 0.35)
  Top 0.152: U10.75 48.6,25 49.7,23.9 49.7,23.25 50.05,22.9 50.2,22.9 50.35,22.75 v52.35,22.75
  Bottom 0.152: v52.35,22.75 52.35,27.6 50.7,29.25 50.7,32.55 51,32.85 51,36.95 50.4,37.55 49.8,37.55 46.15,33.9 46.15,33.75 U$12.P$1
SCL0  (via drill 0.35)
  Top 0.152: 50.3,12.4 49.2,13.5 U10.52 | 50.3,12.4 50.95,11.75 R4.2 | U60.P$1 45.15,5 44.1,5 v43.7,5.4 43.75,5.45 43.75,6.6 44.45,7.3 45.2,7.3 v49.05,11.15 | v38.35,5.7 37.5,4.85 36.7,4.85 U50.6 | v50.05,12.15 50.3,12.4
  Bottom 0.152: U70.23 44.6,5.5 43.75,5.5 43.7,5.45 v43.7,5.4 43.65,5.5 41.45,7.7 38.35,7.7 | 38.35,7.7 35.75,7.7 35.55,7.5 33.65,7.5 33,6.85 33,5.4 32.85,5.25 32.85,4.9 32.9,4.85 U80.14 | 38.35,7.7 v38.35,5.7 | v49.05,11.15 v50.05,12.15
SCL1  (via drill 0.35)
  Top 0.152: U$18.P$1 59.6,8.3 55.7,8.3 55.7,8.55 R17.2 55.7,8.65 55.7,9.55 55.2,10.05 55.2,11.25 v52.75,13.7 | U10.56 48.65,15.5 49.05,15.9 50.85,15.9 51.15,15.6 v51.4,15.6
  Bottom 0.152: v51.4,15.6 51.4,15.05 v52.75,13.7
SDA0  (via drill 0.35)
  Top 0.152: v35.05,1.85 35.05,4.5 35.35,4.8 35.35,5.75 35.7,6.1 36.65,6.1 U50.7 36.75,6.1 37.15,6.1 38.6,7.55 v38.6,8.3 | 45.98,6.58 47.05,7.65 48.2,7.65 49.2,8.65 50.8,8.65 50.85,8.7 R5.2 50.85,10.35 50.8,10.4 50.45,10.4 50.1,10.75 50.1,10.9 48,13 U10.51 | 45.98,6.58 45.9,6.5 45.9,5.8 U60.P$16 | v44.7,6.7 45.85,6.7 45.98,6.58
  Bottom 0.152: v35.05,1.85 34,2.65 33.6,3.05 33.6,3.7 U80.13 | v44.7,6.7 44.65,6.65 44.65,6.05 U70.24 44.55,6 43.6,6 41.55,8.05 38.85,8.05 v38.6,8.3
SDA1  (via drill 0.35)
  Top 0.152: U10.55 46.45,15 46.4,14.95 46.4,14.5 46.25,14.35 46.25,13.35 46.5,13.1 46.5,12.8 v48.2,11.1
  Bottom 0.152: U$18.P$2 62.15,8.35 61.5,8.35 60.05,9.8 59,9.8 58.2,10.6 55.7,10.6 54.15,9.05 54.15,8.6 R16.2 54.15,8.5 54.15,8.05 54.1,8 51.3,8 v48.2,11.1
SERVO_VCC
  Top 0.5: 60.2,12.25 U$3.P$23 | 60.2,14.75 U$3.P$20 60.2,15 | 60.2,17.3 U$3.P$17 60.2,17.55 | 60.2,19.85 U$3.P$14 60.2,20.1 | 60.2,22.4 U$3.P$11 60.2,22.65 | 60.2,24.9 U$3.P$8 60.1,25.2 60.15,25.25 | 60.15,27.45 U$3.P$5 60.15,27.75 | 60.15,29.8 U$3.P$2 60.15,30.05 56.7,33.5 56.7,34.15 56.15,34.19 56.15,34.2 D1.2
  Top 0.813: 60.2,14.75 60.2,12.25 | 60.2,15 60.2,17.3 | 60.2,17.55 60.2,19.85 | 60.2,20.1 60.2,22.4 | 60.2,22.65 60.2,24.9 | 60.15,25.25 60.15,27.45 | 60.15,27.75 60.15,29.8
SPI1_CS3  (via drill 0.35)
  Top 0.152: v42.35,20.3 44,18.65 44,16.65 44.4,16.25 44.4,13.65 43,12.25 43,11 U10.45
  Bottom 0.152: v42.35,20.3 42.35,20.65 42.1,20.9 42.1,21.95 40.7,23.35 40.7,27.95 39.5,29.15 37.5,29.15 36.65,30 36.65,30.4 37.35,31.1 37.35,33.05 U90.2
SPI1_MISO  (via drill 0.35)
  Top 0.152: v40,21.35 40.25,21.1 40.25,20.75 42,19 42,11 U10.43
  Bottom 0.152: v40,21.35 40,25.55 38.25,27.3 34.9,27.3 33.85,28.35 32.45,28.35 31.2,29.6 31.2,30.65 31.85,31.3 31.85,33.45 U90.7
SPI1_MOSI  (via drill 0.35)
  Top 0.152: v40.6,22.65 40.6,21.85 41.15,21.3 42.15,21.3 42.95,20.5 42.95,20.15 44.35,18.75 44.35,16.75 44.75,16.35 44.75,13.25 45.7,12.3 45.75,12.3 46,12.05 46,10.35 45.55,9.9 41.9,9.9 41.5,10.3 41.5,11 U10.42
  Bottom 0.152: v40.6,22.65 40.35,22.9 40.35,27.85 39.4,28.8 37.4,28.8 36.3,29.9 36.3,32.45 36.25,32.5 36.25,33.45 U90.3
SPI1_SCK  (via drill 0.35)
  Top 0.152: v34.05,29.65 34.05,29.55 32.65,28.15 32.65,27.65 v32.4,27.4 | v42.6,12.85 42.35,12.6 42.35,12.2 42.5,12.05 42.5,11 U10.44
  Bottom 0.152: v34.05,29.65 34.05,33.45 U90.5 | v32.4,27.4 33.3,27.4 35.6,25.1 35.6,23.2 34.25,21.85 34.25,18.9 36.6,16.55 38.5,16.55 42.2,12.85 v42.6,12.85
TXD0  (via drill 0.35)
  Top 0.152: v33.9,25.2 34.55,24.55 36.7,24.55 37.5,25.35 37.5,27 U10.92 | v21.15,21.2 21.6,20.75 21.6,17.3 19.9,15.6 16.1,15.6 v13.9,13.4
  Bottom 0.152: v33.9,25.2 32.85,25.2 29.05,29 28.6,29 28.2,28.6 28.2,27.9 25.75,25.45 25.4,25.45 v21.15,21.2 | v13.9,13.4 9.6,13.4 7.75,11.55 7.75,11.35 U$10.3
VBAT  (via drill 0.35)
  Top 0.152: v11.75,21.35 12.8,21.35 13.55,20.6 13.55,20.4 13.6,20.35 14.05,20.35 C42.1 14.15,20.35 14.55,20.35 17.5,23.3 17.5,24.5 17.55,24.55 18.45,24.55 C43.+ 18.5,24.55 19.15,24.55 19.2,24.6 19.2,26.3 R40.2
  Bottom 0.152: v11.75,21.35 11.6,21.2 11.6,16 U40.18
XBEE_CTS  (via drill 0.35)
  Top 0.152: v36.15,28.25 36,28.1 36,27 U10.95 | v35.75,29.65 34,31.4 32.1,31.4 31.65,31.85 27.45,31.85 27.15,32.15 25.45,32.15 25.4,32.1 23,32.1 21.95,31.05 20.2,31.05 19.75,31.5 19.75,33.3 U$10.12
  Bottom 0.152: v36.15,28.25 36.15,29.25 v35.75,29.65
XBEE_RST  (via drill 0.35)
  Top 0.152: U10.70 46.45,22.5 46.05,22.1 v46.05,19.45 | v37.7,17.5 35.4,15.2 35.4,14.75 35.15,14.5 35.15,12.9 v35.1,12.85 | v29.9,9.1 26,9.1 24.55,7.65 15.2,7.65 11.75,11.1 11.75,11.3 U$10.5
  Bottom 0.152: v46.05,19.45 45.5,19.45 42.25,16.2 40.9,16.2 40.7,16.4 39.55,16.4 38.7,17.25 37.95,17.25 v37.7,17.5 | v35.1,12.85 33.85,11.6 32.4,11.6 v29.9,9.1
XBEE_RTS  (via drill 0.35)
  Top 0.152: v36.9,25.55 36.5,25.95 36.5,27 U10.94 | v36.6,20.85 34.9,20.85 33.75,22 v32.75,22 | v30,23.85 28.5,25.35 23.95,25.35 23.7,25.1 v22.95,25.1 | v19.6,28.15 19.6,29.65 17.05,32.2 12.65,32.2 11.75,33.1 11.75,33.3 U$10.16
  Bottom 0.152: v36.9,25.55 38.5,23.95 38.5,22.4 36.95,20.85 v36.6,20.85 | v32.75,22 30.5,22 30.2,22.3 30.2,23.25 30,23.45 v30,23.85 | v22.95,25.1 22.95,25.2 20.6,27.55 20.2,27.55 v19.6,28.15

## Text on the board
tPlace: MegaFly32 1.1 Felix Schill | 2012
tStop: MegaFly32 1.1 Felix Schill | 2012 EPFL